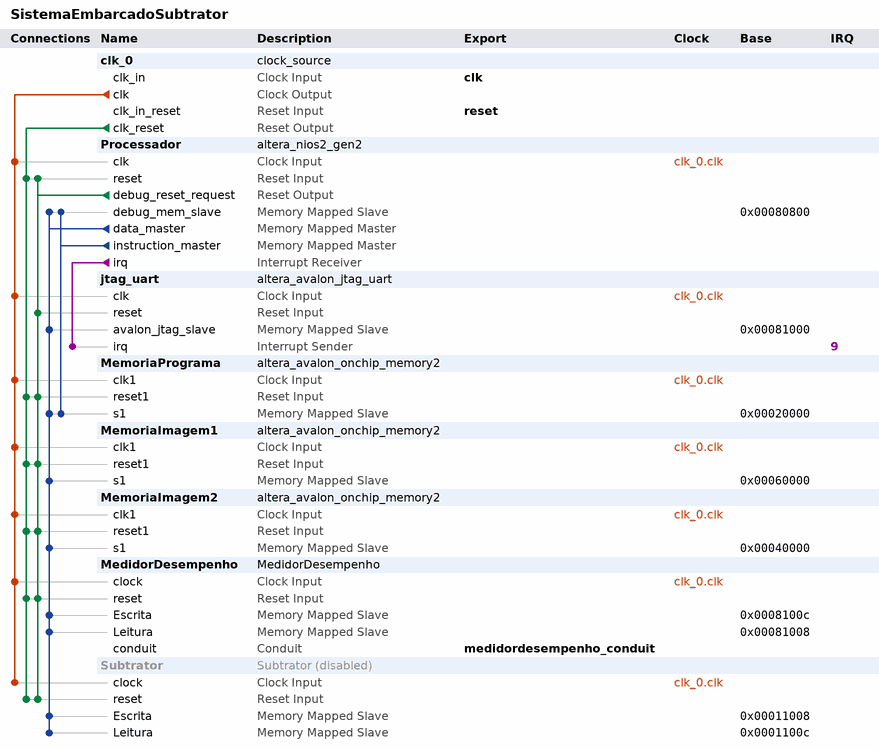
[diagram p0: system contents]
# Platform Designer (Qsys) system SistemaEmbarcadoSubtrator, Cyclone IV E EP4CE115F29C7
# Parameters at their usual value, and those the tool derives, are not listed.
package require -exact qsys 18.1
create_system SistemaEmbarcadoSubtrator
set_project_property DEVICE_FAMILY {Cyclone IV E}
set_project_property DEVICE EP4CE115F29C7

add_instance clk_0 clock_source 18.1
set_instance_parameter_value clk_0 clockFrequency 50000000

add_instance Processador altera_nios2_gen2 18.1
set_instance_parameter_value Processador dcache_size 2048
set_instance_parameter_value Processador exceptionSlave MemoriaPrograma.s1
set_instance_parameter_value Processador icache_size 4096
set_instance_parameter_value Processador impl Tiny
set_instance_parameter_value Processador resetSlave MemoriaPrograma.s1

add_instance jtag_uart altera_avalon_jtag_uart 18.1
set_instance_parameter_value jtag_uart simInteractiveOptions NO_INTERACTIVE_WINDOWS

add_instance MemoriaPrograma altera_avalon_onchip_memory2 18.1
set_instance_parameter_value MemoriaPrograma dataWidth 32
set_instance_parameter_value MemoriaPrograma dualPort false
set_instance_parameter_value MemoriaPrograma initMemContent true
set_instance_parameter_value MemoriaPrograma initializationFileName onchip_mem.hex
set_instance_parameter_value MemoriaPrograma memorySize 131072

add_instance MemoriaImagem1 altera_avalon_onchip_memory2 18.1
set_instance_parameter_value MemoriaImagem1 allowInSystemMemoryContentEditor true
set_instance_parameter_value MemoriaImagem1 dataWidth 8
set_instance_parameter_value MemoriaImagem1 dualPort false
set_instance_parameter_value MemoriaImagem1 initMemContent true
set_instance_parameter_value MemoriaImagem1 initializationFileName D:/Documents/quartusII-data/TesteSomador/imagem1.mif
set_instance_parameter_value MemoriaImagem1 instanceID IMG1
set_instance_parameter_value MemoriaImagem1 memorySize 81920
set_instance_parameter_value MemoriaImagem1 useNonDefaultInitFile true
set_instance_parameter_value MemoriaImagem1 writable false

add_instance MemoriaImagem2 altera_avalon_onchip_memory2 18.1
set_instance_parameter_value MemoriaImagem2 allowInSystemMemoryContentEditor true
set_instance_parameter_value MemoriaImagem2 dataWidth 8
set_instance_parameter_value MemoriaImagem2 dualPort false
set_instance_parameter_value MemoriaImagem2 initMemContent true
set_instance_parameter_value MemoriaImagem2 initializationFileName D:/Documents/quartusII-data/TesteSomador/imagem2.mif
set_instance_parameter_value MemoriaImagem2 instanceID IMG2
set_instance_parameter_value MemoriaImagem2 memorySize 81920
set_instance_parameter_value MemoriaImagem2 useNonDefaultInitFile true
set_instance_parameter_value MemoriaImagem2 writable false

add_instance MedidorDesempenho MedidorDesempenho 1.0

add_instance Subtrator Subtrator 1.0
set_instance_property Subtrator ENABLED false

# connections
add_connection clk_0.clk jtag_uart.clk clock
add_connection clk_0.clk MedidorDesempenho.clock clock
add_connection clk_0.clk MemoriaImagem1.clk1 clock
add_connection clk_0.clk MemoriaImagem2.clk1 clock
add_connection clk_0.clk MemoriaPrograma.clk1 clock
add_connection clk_0.clk Processador.clk clock
add_connection clk_0.clk Subtrator.clock clock
add_connection clk_0.clk_reset MedidorDesempenho.reset reset
add_connection clk_0.clk_reset MemoriaImagem1.reset1 reset
add_connection clk_0.clk_reset MemoriaImagem2.reset1 reset
add_connection clk_0.clk_reset MemoriaPrograma.reset1 reset
add_connection clk_0.clk_reset Processador.reset reset
add_connection clk_0.clk_reset Subtrator.reset reset
add_connection Processador.debug_reset_request jtag_uart.reset reset
add_connection Processador.debug_reset_request MedidorDesempenho.reset reset
add_connection Processador.debug_reset_request MemoriaImagem1.reset1 reset
add_connection Processador.debug_reset_request MemoriaImagem2.reset1 reset
add_connection Processador.debug_reset_request MemoriaPrograma.reset1 reset
add_connection Processador.debug_reset_request Processador.reset reset
add_connection Processador.debug_reset_request Subtrator.reset reset
add_connection Processador.data_master jtag_uart.avalon_jtag_slave avalon
set_connection_parameter_value Processador.data_master/jtag_uart.avalon_jtag_slave baseAddress 0x00081000
add_connection Processador.data_master MedidorDesempenho.Escrita avalon
set_connection_parameter_value Processador.data_master/MedidorDesempenho.Escrita baseAddress 0x0008100c
add_connection Processador.data_master MedidorDesempenho.Leitura avalon
set_connection_parameter_value Processador.data_master/MedidorDesempenho.Leitura baseAddress 0x00081008
add_connection Processador.data_master MemoriaImagem1.s1 avalon
set_connection_parameter_value Processador.data_master/MemoriaImagem1.s1 baseAddress 0x00060000
add_connection Processador.data_master MemoriaImagem2.s1 avalon
set_connection_parameter_value Processador.data_master/MemoriaImagem2.s1 baseAddress 0x00040000
add_connection Processador.data_master MemoriaPrograma.s1 avalon
set_connection_parameter_value Processador.data_master/MemoriaPrograma.s1 baseAddress 0x00020000
add_connection Processador.data_master Processador.debug_mem_slave avalon
set_connection_parameter_value Processador.data_master/Processador.debug_mem_slave baseAddress 0x00080800
add_connection Processador.data_master Subtrator.Escrita avalon
set_connection_parameter_value Processador.data_master/Subtrator.Escrita baseAddress 0x00011008
add_connection Processador.data_master Subtrator.Leitura avalon
set_connection_parameter_value Processador.data_master/Subtrator.Leitura baseAddress 0x0001100c
add_connection Processador.instruction_master MemoriaPrograma.s1 avalon
set_connection_parameter_value Processador.instruction_master/MemoriaPrograma.s1 baseAddress 0x00020000
add_connection Processador.instruction_master Processador.debug_mem_slave avalon
set_connection_parameter_value Processador.instruction_master/Processador.debug_mem_slave baseAddress 0x00080800
add_connection Processador.irq jtag_uart.irq interrupt
set_connection_parameter_value Processador.irq/jtag_uart.irq irqNumber 9

# exported interfaces
add_interface clk clock sink
set_interface_property clk EXPORT_OF clk_0.clk_in
add_interface medidordesempenho_conduit conduit end
set_interface_property medidordesempenho_conduit EXPORT_OF MedidorDesempenho.conduit
add_interface reset reset sink
set_interface_property reset EXPORT_OF clk_0.clk_in_reset

set_interconnect_requirement {$system} qsys_mm.clockCrossingAdapter HANDSHAKE
set_interconnect_requirement {$system} qsys_mm.enableEccProtection FALSE
set_interconnect_requirement {$system} qsys_mm.insertDefaultSlave FALSE
set_interconnect_requirement {$system} qsys_mm.maxAdditionalLatency 1

save_system SistemaEmbarcadoSubtrator.qsys
